# Altium project Matrix_LED_v2.PrjPcb
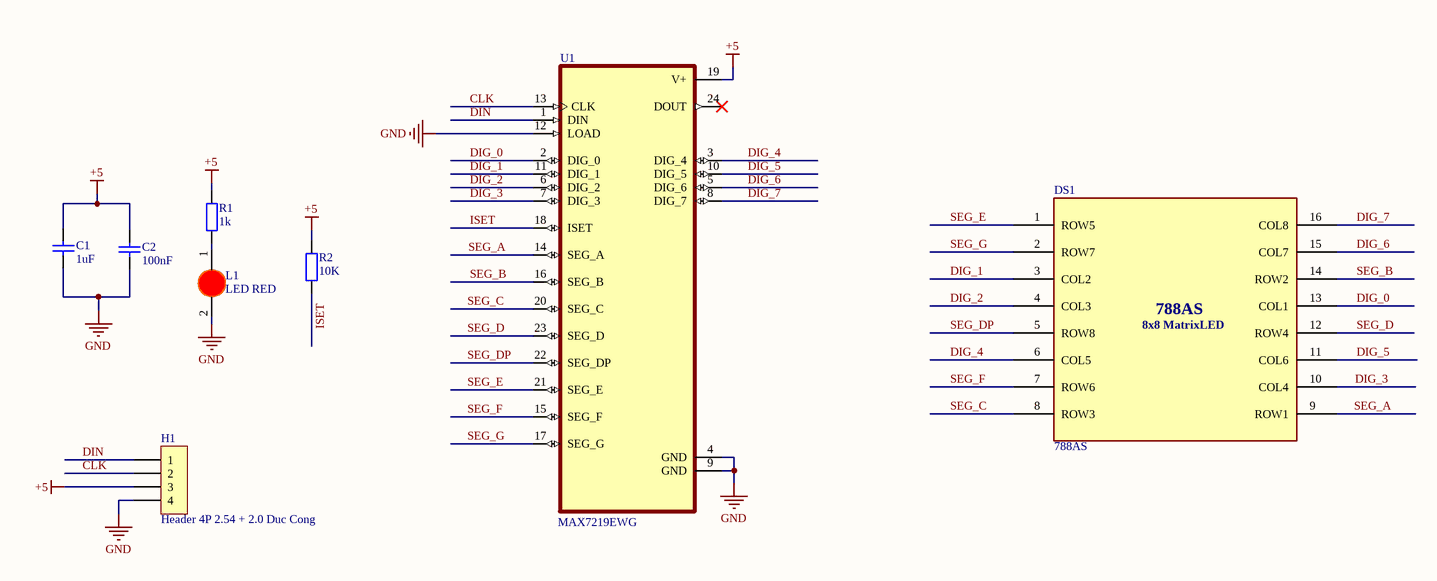
[diagram p0: MatrixLED_v2_SCH.SchDoc]
1 sheet, 8 parts. Net scope: global (net labels, ports and power ports of the same name join across sheets).
Board file: MatrixLED_v2_PCB.PcbDoc

## Sheet MatrixLED_v2_SCH.SchDoc
size 400 x 299 mm; SheetNumber: 1; SheetTotal: 1

### Parts
C1  1uF  [tu 0603]
C2  100nF  [tu 0603]
DS1  788AS  [788AS]
H1  Header 4P 2.54 + 2.0 Duc Cong  [Header 4P DC 2.54 + 2.0]
L1  LED RED  [LED-0805-Red]
R1  1k  [tro smd 0603]
R2  10K  [tro smd 0603]
U1  MAX7219EWG  [SOIC127P1032X265-24N]

### Nets
+5: C1.1 C2.1 H1.3 R1.2 R2.2 U1.19(V+)
GND: C1.2 C2.2 H1.4 L1.2(K) U1.4(GND) U1.9(GND) U1.12(LOAD)
CLK: H1.2 U1.13(CLK)
DIG_0: DS1.13(COL1) U1.2(DIG_0)
DIG_1: DS1.3(COL2) U1.11(DIG_1)
DIG_2: DS1.4(COL3) U1.6(DIG_2)
DIG_3: DS1.10(COL4) U1.7(DIG_3)
DIG_4: DS1.6(COL5) U1.3(DIG_4)
DIG_5: DS1.11(COL6) U1.10(DIG_5)
DIG_6: DS1.15(COL7) U1.5(DIG_6)
DIG_7: DS1.16(COL8) U1.8(DIG_7)
DIN: H1.1 U1.1(DIN)
ISET: R2.1 U1.18(ISET)
SEG_A: DS1.9(ROW1) U1.14(SEG_A)
SEG_B: DS1.14(ROW2) U1.16(SEG_B)
SEG_C: DS1.8(ROW3) U1.20(SEG_C)
SEG_D: DS1.12(ROW4) U1.23(SEG_D)
SEG_DP: DS1.5(ROW8) U1.22(SEG_DP)
SEG_E: DS1.1(ROW5) U1.21(SEG_E)
SEG_F: DS1.7(ROW6) U1.15(SEG_F)
SEG_G: DS1.2(ROW7) U1.17(SEG_G)
NetL1_1: L1.1(A) R1.1

Not connected (* = marked no-connect by the designer): U1 24(DOUT)*

### Notes on the sheet
- (in symbol 788AS) 8x8 MatrixLED

### Library data of the parts
C1 C2 = Tu 0603 104 50V 10%: Dán; Don_Vi: Con; So_Chan: 2; Ten_Linh_Kien: Tụ 0603 104-100nF 10% 50V; Ma_Hang: MH004568; Chung_Loai: Dán; Kieu_Chan: *
DS1 = 788AS: 31.70mm (1.2â€) 3.0x3.0 SQUARE dot matrix LED display.BI-COLOR; MF: Betlux; MP: BL-M12A883-DUG; SnapEDA_Link: https://www.snapeda.com/parts/BL-M12A883-DUG/Betlux/view-part/?ref=snap; Package: None; Value: *; Check_prices: https://www.snapeda.com/parts/BL-M12A883-DUG/Betlux/view-part/?ref=eda
H1 = Header 4P 2.54 + 2.0 Duc Cong: Cắm; Ten_Linh_Kien: Header 4P XH2.54-4P Đực Cong; Don_Vi: Con; Ma_Hang: MH001310; Chung_Loai: Cắm
L1 = LED 0805 Do: Dán; Don_Vi: Con; Ma_Hang: MH000897; Ten_Linh_Kien: LED 0805 Màu Đỏ (Red); Ghi_Chu: *; Kieu_Chan: *; Chung_Loai: Dán
R1 = Tro 0603 1% 1k: Dán; So_Chan: 2; Don_Vi: Con; Ten_Linh_Kien: Trở 0603 1% 1k; Ma_Hang: MH006334; Chung_Loai: Dán; Kieu_Chan: *
R2 = Tro 0603 1% 10k: Dán; Don_Vi: Con; So_Chan: 2; Ten_Linh_Kien: Trở 0603 1% 10k; Ma_Hang: MH006333; Chung_Loai: Dán; Kieu_Chan: *
U1 = MAX7219EWG: LED Driver 64 Segment 330000uA Supply Current 24-Pin SOIC W Tube; MF: Analog Devices; MP: MAX7219EWG+; SnapEDA_Link: https://www.snapeda.com/parts/MAX7219EWG+/Analog+Devices/view-part/?ref=snap; Package: SOIC-24 Maxim; Value: *; Check_prices: https://www.snapeda.com/parts/MAX7219EWG+/Analog+Devices/view-part/?ref=eda